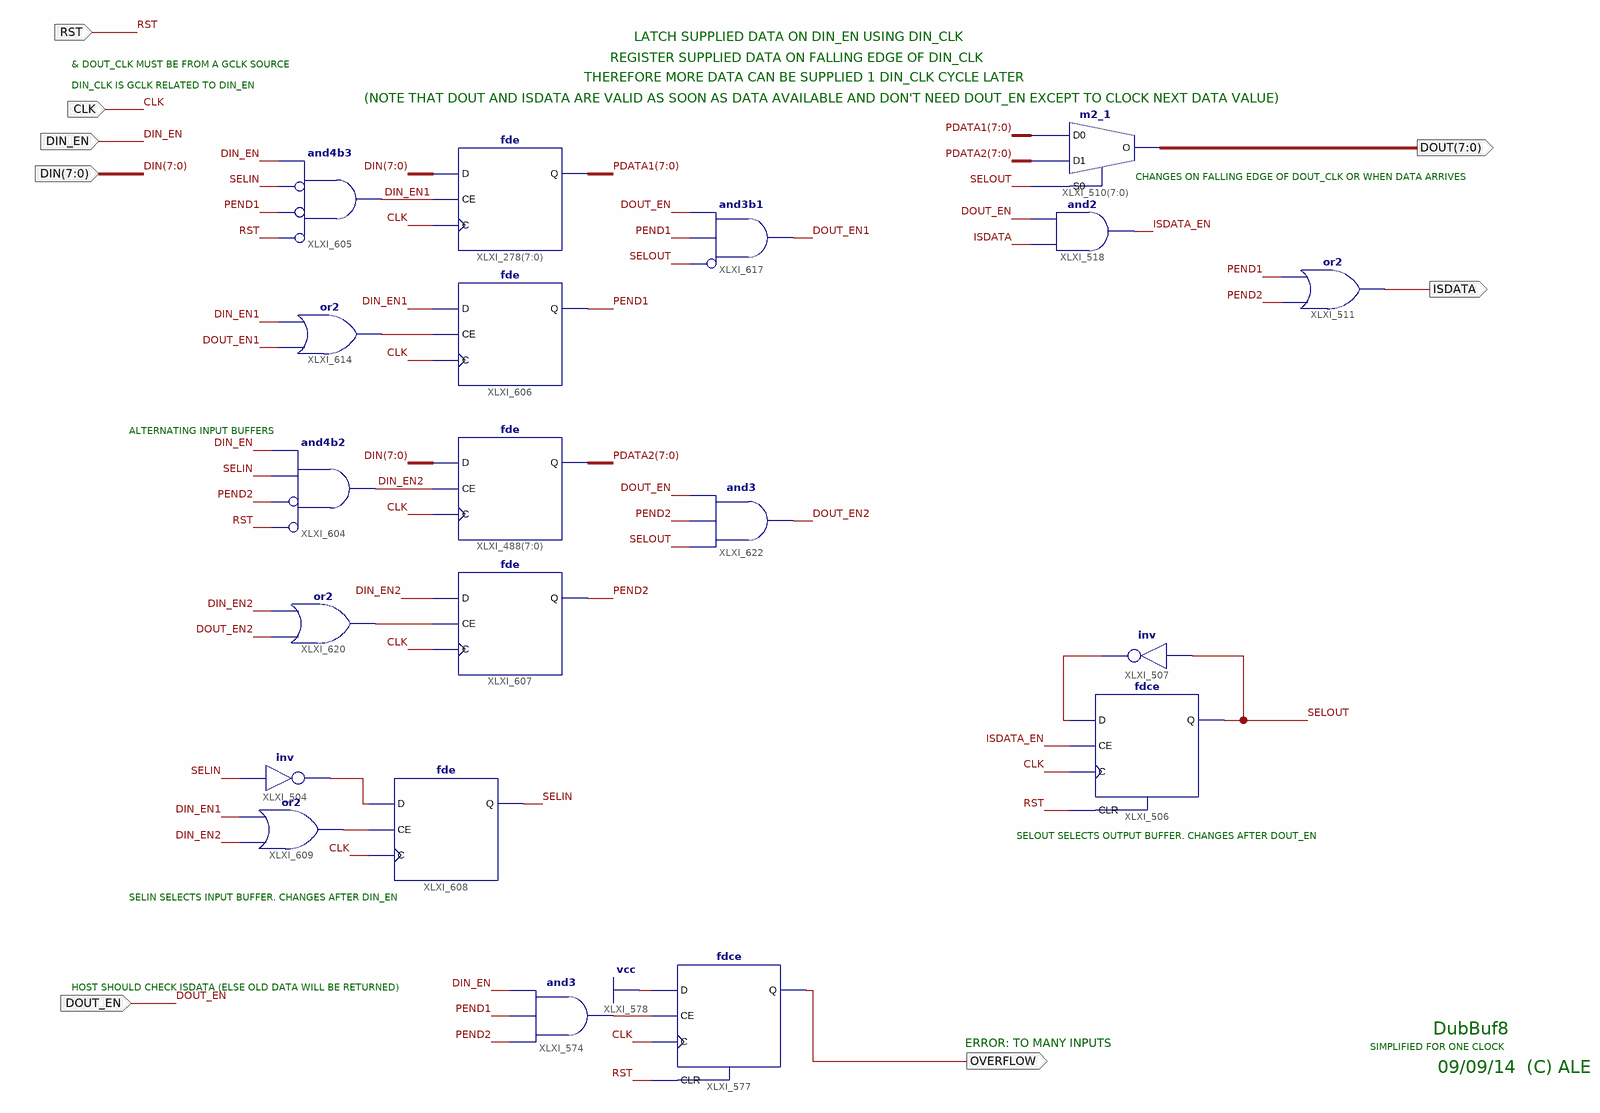
[diagram p0: schematic sheet 1]
// Xilinx ISE schematic DubBuf8.sch (spartan3e) as structural Verilog: 20 symbols, 8 ports
module DubBuf8 (
  input  RST,
  input  DOUT_EN,
  input  [7:0] DIN,
  input  DIN_EN,
  input  CLK,
  output [7:0] DOUT,
  output ISDATA,
  output OVERFLOW
);

  wire DIN_EN1, DIN_EN2, DOUT_EN1, DOUT_EN2, ISDATA_EN, PEND1, PEND2, SELIN, SELOUT, XLXN_1279, XLXN_1501,
       XLXN_1524, XLXN_1526, XLXN_1536, XLXN_1558;
  wire [7:0] PDATA1, PDATA2;

  and XLXI_518 (ISDATA_EN, ISDATA, DOUT_EN);
  m2_1 XLXI_510[7:0] (.D0(PDATA1), .D1(PDATA2), .S0(SELOUT), .O(DOUT));
  fde XLXI_278[7:0] (.C(CLK), .CE(DIN_EN1), .D(DIN), .Q(PDATA1));
  fde XLXI_488[7:0] (.C(CLK), .CE(DIN_EN2), .D(DIN), .Q(PDATA2));
  fdce XLXI_577 (.C(CLK), .CE(XLXN_1501), .CLR(RST), .D(1'b1), .Q(OVERFLOW));
  and XLXI_574 (XLXN_1501, PEND2, PEND1, DIN_EN);
  and XLXI_604 (DIN_EN2, ~RST, ~PEND2, SELIN, DIN_EN);  // and4b2
  and XLXI_605 (DIN_EN1, ~RST, ~PEND1, ~SELIN, DIN_EN);  // and4b3
  fde XLXI_606 (.C(CLK), .CE(XLXN_1536), .D(DIN_EN1), .Q(PEND1));
  fde XLXI_607 (.C(CLK), .CE(XLXN_1558), .D(DIN_EN2), .Q(PEND2));
  fde XLXI_608 (.C(CLK), .CE(XLXN_1526), .D(XLXN_1524), .Q(SELIN));
  not XLXI_504 (XLXN_1524, SELIN);
  or XLXI_609 (XLXN_1526, DIN_EN2, DIN_EN1);
  or XLXI_614 (XLXN_1536, DOUT_EN1, DIN_EN1);
  and XLXI_617 (DOUT_EN1, ~SELOUT, PEND1, DOUT_EN);  // and3b1
  or XLXI_620 (XLXN_1558, DOUT_EN2, DIN_EN2);
  and XLXI_622 (DOUT_EN2, SELOUT, PEND2, DOUT_EN);
  or XLXI_511 (ISDATA, PEND2, PEND1);
  fdce XLXI_506 (.C(CLK), .CE(ISDATA_EN), .CLR(RST), .D(XLXN_1279), .Q(SELOUT));
  not XLXI_507 (XLXN_1279, SELOUT);

  // Notes on the sheet:
  //   LATCH SUPPLIED DATA ON DIN_EN USING DIN_CLK
  //   REGISTER SUPPLIED DATA ON FALLING EDGE OF DIN_CLK
  //   & DOUT_CLK MUST BE FROM A GCLK SOURCE
  //   THEREFORE MORE DATA CAN BE SUPPLIED 1 DIN_CLK CYCLE LATER
  //   DIN_CLK IS GCLK RELATED TO DIN_EN
  //   (NOTE THAT DOUT AND ISDATA ARE VALID AS SOON AS DATA AVAILABLE AND DON'T NEED DOUT_EN EXCEPT TO CLOCK NEXT DATA VALUE)
  //   CHANGES ON FALLING EDGE OF DOUT_CLK OR WHEN DATA ARRIVES
  //   ALTERNATING INPUT BUFFERS
  //   SELOUT SELECTS OUTPUT BUFFER. CHANGES AFTER DOUT_EN
  //   SELIN SELECTS INPUT BUFFER. CHANGES AFTER DIN_EN
  //   HOST SHOULD CHECK ISDATA (ELSE OLD DATA WILL BE RETURNED)
  //   DubBuf8
  //   ERROR: TO MANY INPUTS
  //   SIMPLIFIED FOR ONE CLOCK
  //   09/09/14  (C) ALE
endmodule
